# EAGLE design mainTest (EAGLE 7.6.0)
Components for pcb
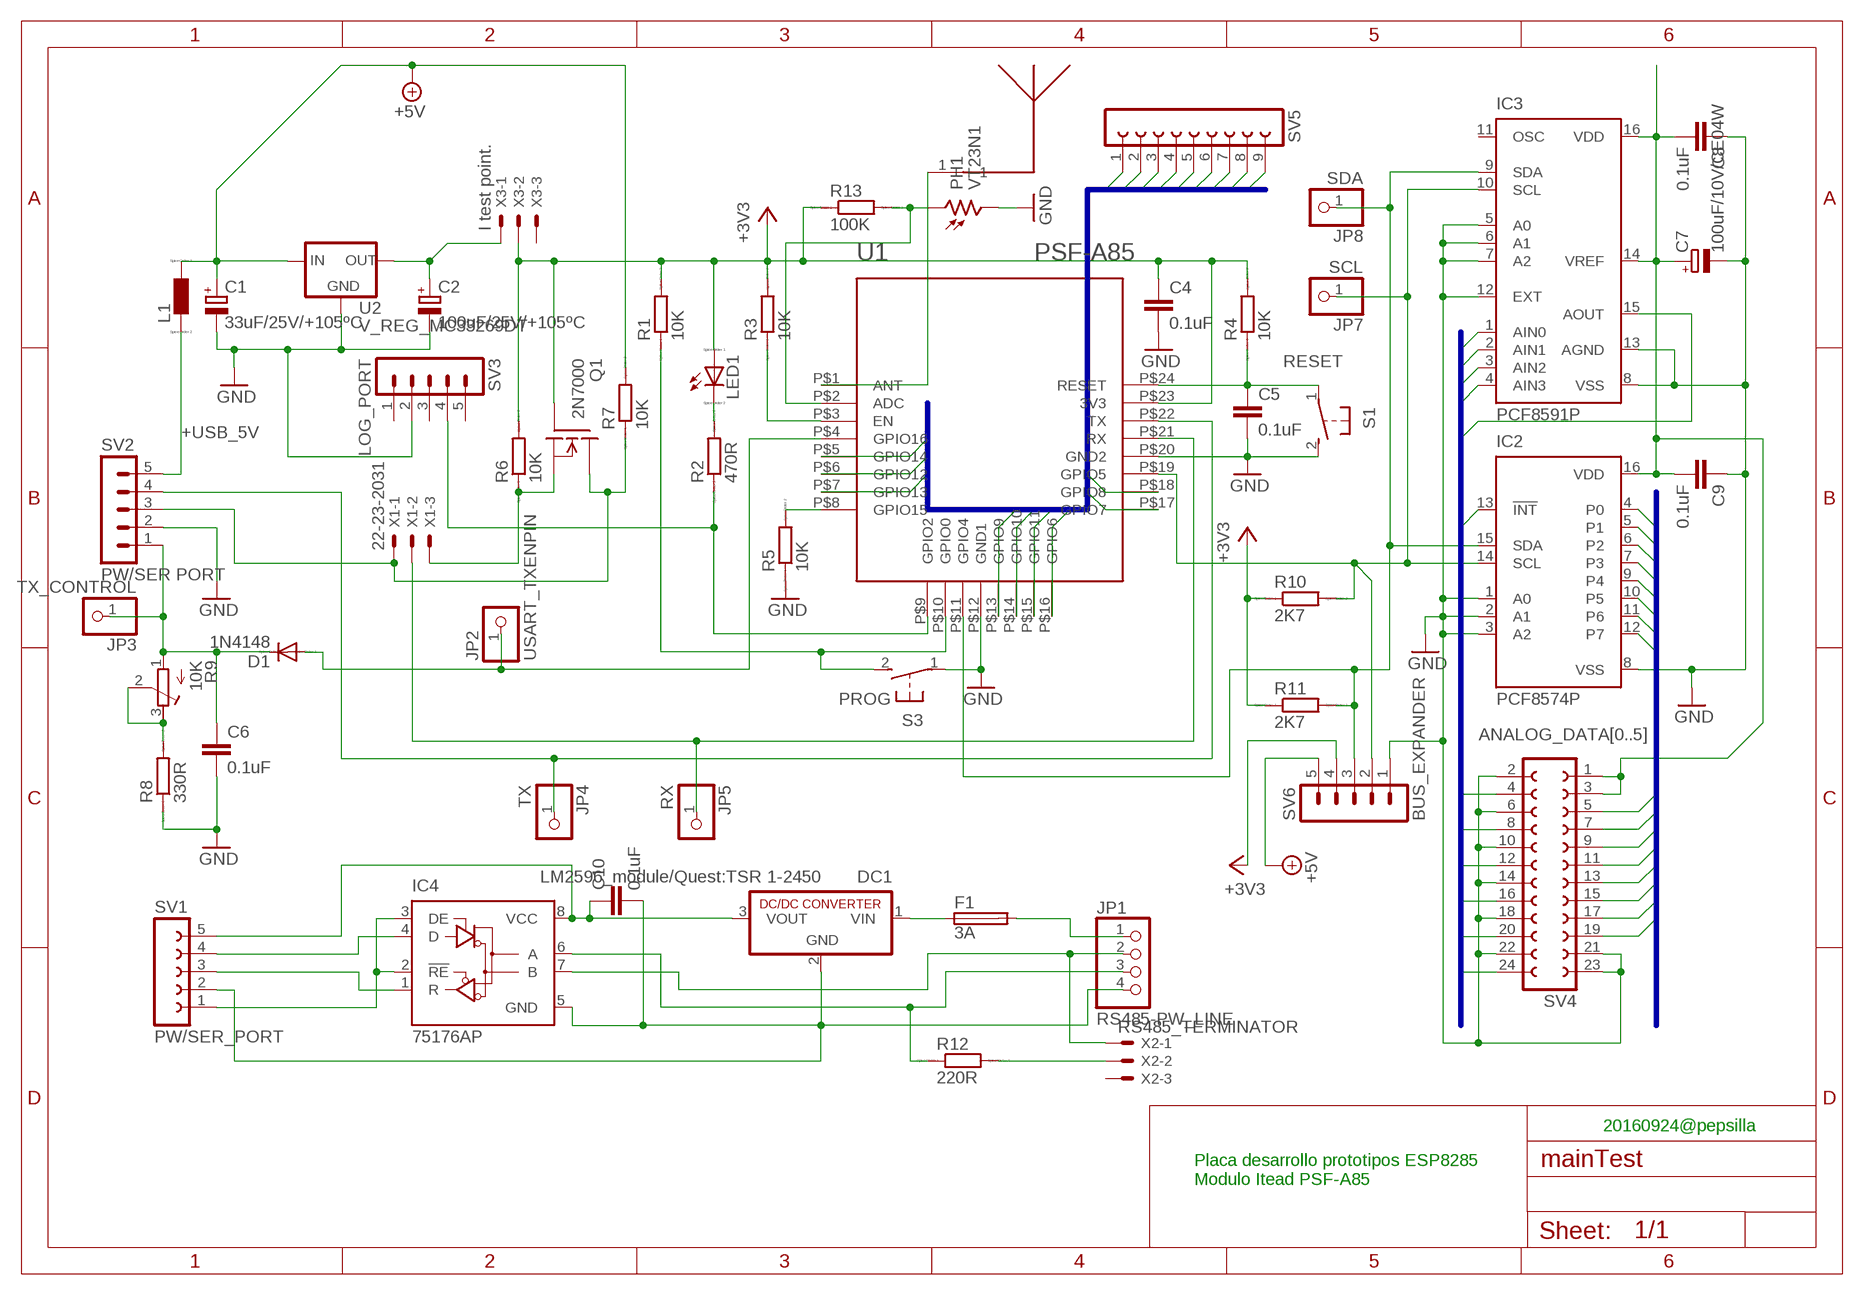
[diagram p0: schematic, sheet 1]

## Parts
C1  33uF/25V/+105ºC  CPOL-EUE3.5-10  [E3,5-10]
C2  100uF/25V/+105ºC  CPOL-EUE3.5-10  [E3,5-10]
C4  0.1uF  C-EU025-030X050  [C025-030X050]
C5  0.1uF  C-EU025-030X050  [C025-030X050]
C6  0.1uF  C-EU025-030X050  [C025-030X050]
C7  100uF/10V/CE04W  CPOL-EUE3.5-10  [E3,5-10]
C8  0.1uF  C-EU025-030X050  [C025-030X050]
C9  0.1uF  C-EU025-030X050  [C025-030X050]
C10  0.1uF  C-EU025-030X050  [C025-030X050]
D1  1N4148  MBR0520LT  [SOD123]
DC1  LM2596_module/Quest:TSR 1-2450  R-78C9.0-1.0  [SIP3]
F1  3A  TR5  [TR5]
IC2  PCF8574P  [DIL16]
IC3  PCF8591P  [DIL16]
IC4  75176AP  [DIL08]
JP1  RS485-PW_LINE  PINHD-1X4  [1X04]
JP2  USART_TXENPIN  PINHD-1X1  [1X01]
JP3  TX_CONTROL  PINHD-1X1  [1X01]
JP4  TX  PINHD-1X1  [1X01]
JP5  RX  PINHD-1X1  [1X01]
JP7  SCL  PINHD-1X1  [1X01]
JP8  SDA  PINHD-1X1  [1X01]
L1  L0207/10  [0207/10]
LED1  LED_E  [LED_1206]
PH1  VT23N1  [TO46-VT200]
Q1  2N7000  BSS295  [TO92]
R1  10K  R  [R0805]
R2  470R  R  [R0805]
R3  10K  R  [R0805]
R4  10K  R  [R0805]
R5  10K  R  [R0805]
R6  10K  R  [R0805]
R7  10K  R  [R0805]
R8  330R  R  [R0805]
R9  10K  R-TRIMM3296X  [RTRIM3296X]
R10  2K7  R  [R0805]
R11  2K7  R  [R0805]
R12  220R  R  [R0805]
R13  100K  R  [R0805]
S1  31-XX  [B3F-31XX]
S3  31-XX  [B3F-31XX]
SV1  PW/SER_PORT  FE05-1  [FE05-1]
SV2  PW/SER PORT  MA05-1  [MA05-1]
SV3  LOG_PORT  MA05-1  [MA05-1]
SV4  FE12-2  [FE12-2]
SV5  FE09-1  [FE09]
SV6  BUS_EXPANDER  MA05-1  [MA05-1]
U1  PSF-A85  [PSF-A85]
U2  V_REG_MC33269DT  [DPAK]
U$1  PCB-2G4-ANTENNA  [PCB-2G4-ANTENNA]
X1  22-23-2031  [22-23-2031]
X2  RS485_TERMINATOR  22-23-2031  [22-23-2031]
X3  I test point.  22-23-2031  [22-23-2031]

## Nets
+3V3: C4.1 LED1.A Q1.1(G) R1.2 R3.2 R4.2 R6.2 R10.1 R11.1 R13.1 SV6.4 U1.P$23(3V3) X3.2
+5V: C1.+ L1.1 R7.2 SV6.5 U2.3(IN)
+USB_5V: L1.2 SV2.5
ANALOG_DATA0: IC3.4(AIN3) SV4.4
ANALOG_DATA1: IC3.3(AIN2) SV4.8
ANALOG_DATA2: IC3.2(AIN1) SV4.12
ANALOG_DATA3: IC3.1(AIN0) SV4.16
ANALOG_DATA4: IC3.15(AOUT) SV4.20
ANALOG_DATA5: IC2.13(!INT) SV4.24
DIGITAL_DATA0: IC2.4(P0) SV4.5
DIGITAL_DATA1: IC2.5(P1) SV4.7
DIGITAL_DATA2: IC2.6(P2) SV4.9
DIGITAL_DATA3: IC2.7(P3) SV4.11
DIGITAL_DATA4: IC2.9(P4) SV4.13
DIGITAL_DATA5: IC2.10(P5) SV4.15
DIGITAL_DATA6: IC2.11(P6) SV4.17
DIGITAL_DATA7: IC2.12(P7) SV4.19
GND: C1.- C2.- C4.2 C5.2 C6.2 C7.- C8.1 C9.1 IC2.1(A0) IC2.2(A1) IC2.3(A2) IC2.8(VSS) IC3.5(A0) IC3.6(A1) IC3.7(A2) IC3.8(VSS) IC3.12(EXT) IC3.13(AGND) PH1.2 R5.1 R8.1 S1.2(S) S3.1(P) SV2.2 SV3.2 SV4.2 SV4.6 SV4.10 SV4.14 SV4.18 SV4.21 SV4.22 SV4.23 SV6.1 U1.P$12(GND1) U1.P$20(GND2) U2.1(GND)
N$1: PH1.1 R13.2 U1.P$2(ADC)
N$2: R3.1 U1.P$3(EN)
N$3: R2.1 SV3.4 U1.P$9(GPIO2)
N$4: R1.1 S3.2(S) U1.P$10(GPIO0)
N$5: R5.2 U1.P$8(GPIO15)
N$6: DC1.1(VIN) F1.1
N$7: IC2.15(SDA) IC3.9(SDA) JP8.1 R11.2 SV6.3 U1.P$11(GPIO4)
N$8: C10.1 DC1.3(VOUT) IC4.8(VCC) SV1.5
N$9: C10.2 DC1.2(GND) IC4.5(GND) JP1.4 SV1.2
N$10: IC2.14(SCL) IC3.10(SCL) JP7.1 R10.2 SV6.2 U1.P$19(GPIO5)
N$11: F1.2 JP1.1
N$12: R8.2 R9.2(S) R9.3(E)
N$13: Q1.3(S) R6.1 X1.3
N$14: LED1.C R2.2
N$15: D1.A JP2.1 U1.P$4(GPIO16)
N$16: IC4.7(B) JP1.2 X2.1
N$17: IC4.6(A) JP1.3 R12.1
N$18: IC4.2(!RE) IC4.3(DE) SV1.1
N$19: IC4.1(R) SV1.3
N$20: IC4.4(D) SV1.4
N$21: R12.2 X2.2
N$22: C2.+ U2.4(OUT) X3.1
N$24: C6.1 D1.C JP3.1 R9.1(A) SV2.1
N$32: C7.+ C8.2 C9.2 IC2.16(VDD) IC3.14(VREF) IC3.16(VDD) SV4.1 SV4.3
N$33: U1.P$1(ANT) U$1.1
PIN_HEADER0: SV5.1 U1.P$5(GPIO14)
PIN_HEADER1: SV5.2 U1.P$6(GPIO12)
PIN_HEADER2: SV5.3 U1.P$7(GPIO13)
PIN_HEADER3: SV5.4 U1.P$13(GPIO9)
PIN_HEADER4: SV5.5 U1.P$14(GPIO10)
PIN_HEADER5: SV5.6 U1.P$15(GPIO11)
PIN_HEADER6: SV5.7 U1.P$16(GPIO6)
PIN_HEADER7: SV5.8 U1.P$17(GPIO7)
PIN_HEADER8: SV5.9 U1.P$18(GPIO8)
PROG: JP5.1 U1.P$21(RX) X1.2
RESET: C5.1 R4.1 S1.1(P) U1.P$24(RESET)
RX: JP4.1 SV2.4 U1.P$22(TX)
TX: Q1.2(D) R7.1 SV2.3 X1.1
Unconnected: IC3.11(OSC) SV3.1 SV3.3 SV3.5 X2.3 X3.3

## Buses
DIGITAL_DATA[0..7]
ANALOG_DATA[0..5]
PIN_HEADER[0..8]

## Notes on the sheet
- 20160924@pepsilla
- Placa desarrollo prototipos ESP8285
  Modulo Itead PSF-A85

## Library data of the parts
C1 C2 C7 = rcl:CPOL-EU: POLARIZED CAPACITOR, European symbol
C4-C6 C8-C10 = rcl:C-EU: CAPACITOR, European symbol
D1 = diode:MBR0520LT: SCHOTTKY BARRIER RECTIFIER Source: http://onsemi.com .. MBR0520LT1-D.pdf
DC1 = dc-dc-converter:R-78C*-1.0: INNOLINE DC/DC-Converter 1.0 AMP SIP3 Single Output Source: Data sheet <http://www.mikrocontroller.net/attachment/150645/157764-da-01-en-DC_DC_WANDLER_R_78C5_0_1_0.pdf>
F1 = fuse:TR5: FUSE Wickmann; OC_FARNELL: unknown; OC_NEWARK: unknown
IC2 = micro-philips:PCF8574: I2C-Bus Remote 8-bit I/O expander http://www.semiconductors.philips.com/acrobat_download/datasheets/PCF8574_4.pdf; MPN: PCF8574PN; OC_FARNELL: 204020; OC_NEWARK: 11N8515
IC3 = micro-philips:PCF8591: I2C-Bus D/A CONVERTER; MF: FARNELL; MPN: PCF8591P; OC_FARNELL: 396412; OC_NEWARK: 07WX3385
IC4 = 751xx:75176A: DIFFERENTIAL BUS TRANSCEIVER Source: http://focus.ti.com/lit/ds/symlink/sn75176a.pdf
JP1 = pinhead:PINHD-1X4: PIN HEADER
JP2-JP5 JP7 JP8 = pinhead:PINHD-1X1: PIN HEADER
L1 = eagle-ltspice:L: INDUCTOR, European symbol; SPICEMODEL: NONE; SPICEPREFIX: L
LED1 = eagle-ltspice:LED_E: LED Source: http://www.osram.convergy.de Source: www.luxeon.com Source: www.kingbright.com; SPICEMODEL: NONE; SPICEPREFIX: D; SPICETYPE: diode
PH1 = photo-elements:VT2*: Photoconductive Cell VT200 Series Source: http://optoelectronics.perkinelmer.com/content/Datasheets/DTS_vt200seriesdatasheet.pdf
Q1 = transistor-fet:BSS295: N-Channel Enhancement MOSFET not checked
R1-R8 R10-R13 = eagle-ltspice:R: RESISTOR, European symbol; SPICEMODEL: NONE; SPICEPREFIX: R
R9 = resistor:R-TRIMM: Trimm resistor
S1 S3 = switch-omron:31-XX: OMRON SWITCH; MPN: B3F-3100; OC_FARNELL: 959704; OC_NEWARK: 36M3582
SV1 = con-lsta:FE05-1: FEMALE HEADER; OC_FARNELL: unknown; OC_NEWARK: unknown
SV2 SV3 SV6 = con-lstb:MA05-1: PIN HEADER; OC_FARNELL: unknown; OC_NEWARK: unknown
SV4 = con-lsta:FE12-2: FEMALE HEADER; OC_FARNELL: unknown; OC_NEWARK: unknown
SV5 = con-lsta:FE09-1: FEMALE HEADER; OC_FARNELL: unknown; OC_NEWARK: unknown
U1 = ITEAD:PSF-A85
U2 = SparkFun-PowerIC:V_REG_MC33269
U$1 = ITEAD:PCB-2G4-ANTENNA
X1-X3 = con-molex:22-23-2031: .100" (2.54mm) Center Header - 3 Pin; MF: MOLEX; MPN: 22-23-2031; OC_FARNELL: 1462950; OC_NEWARK: 30C0862

## Board
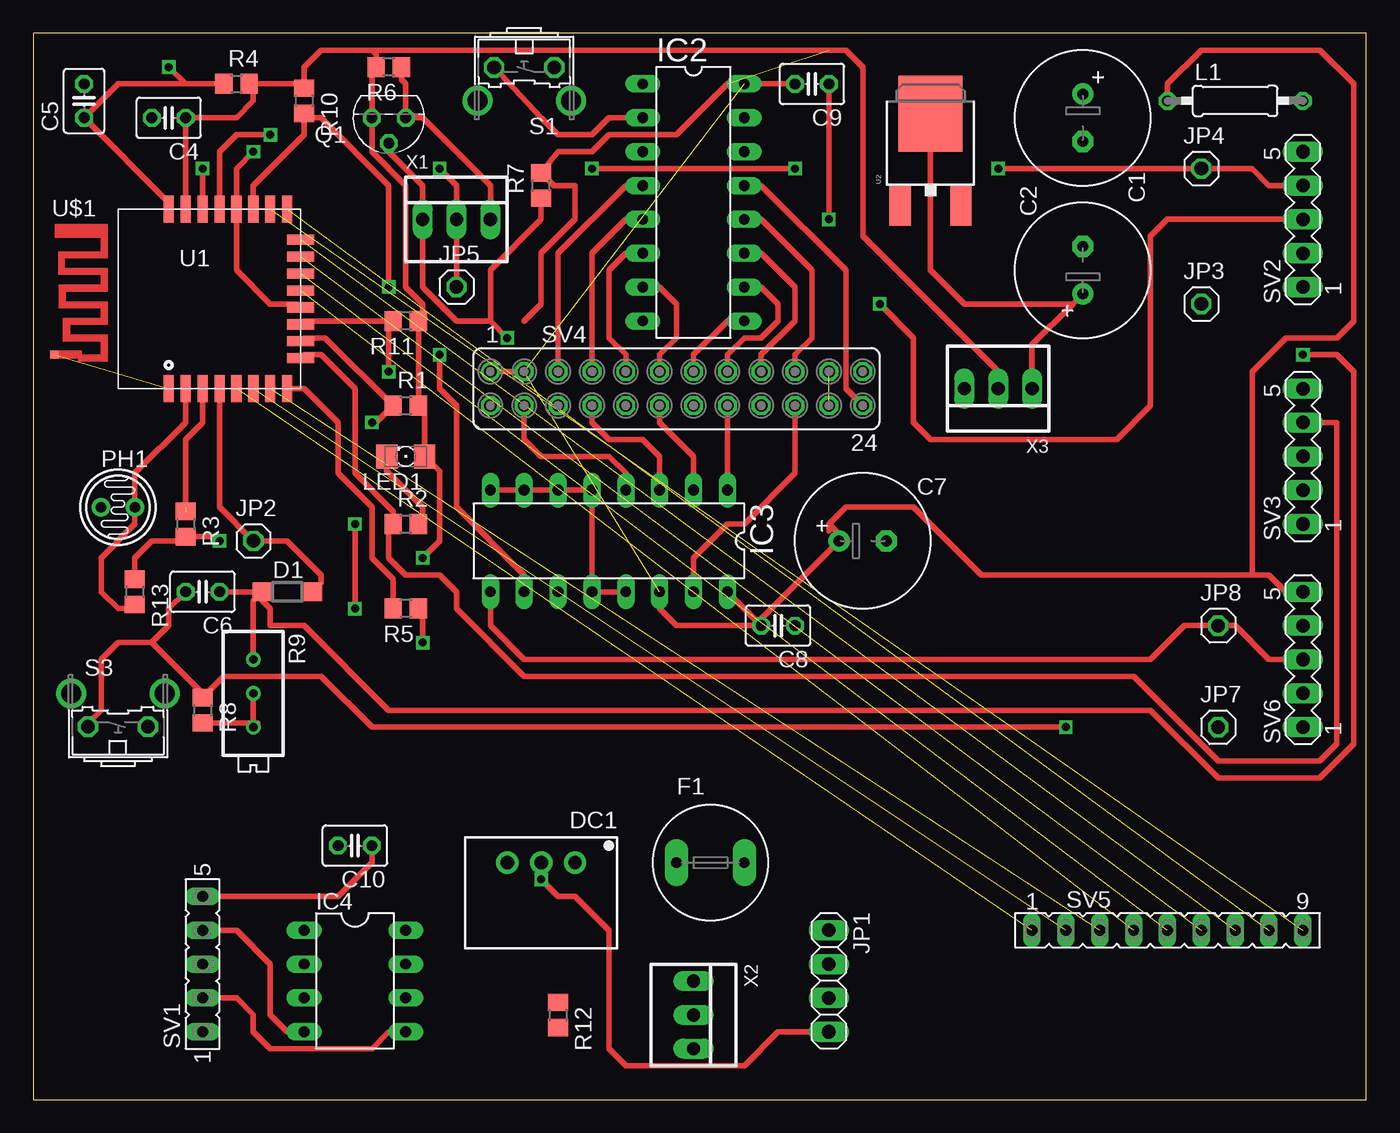
[diagram p1: board, top side]
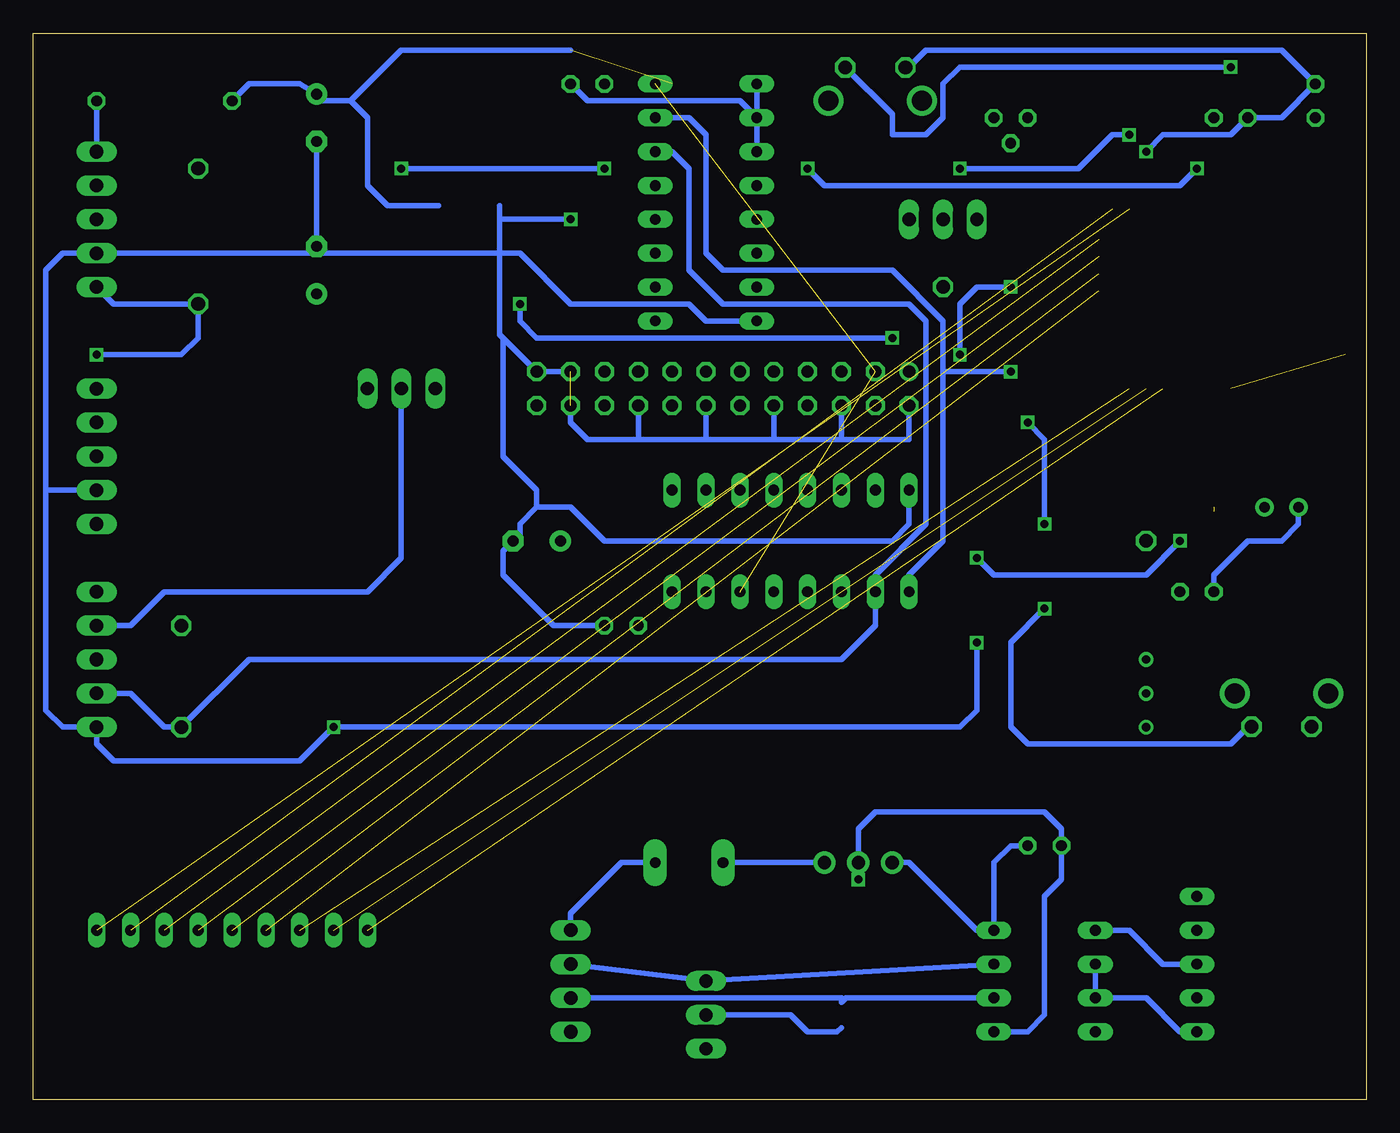
[diagram p2: board, bottom side, seen from below]

Size 100 x 80 mm. Coordinates in mm from the lower left corner, seen from the top.
Outline: 0,0 100,0 100,80 0,80 0,0
Copper layers (1*16): Top 0.035mm / dielectric 1.5mm / Bottom 0.035mm
Design rules "default": minimum track width 10mil, minimum drill 24mil, track to track 8mil, track to pad 8mil, pad to pad 8mil, via to via 8mil, smd to smd 8mil, copper to edge 40mil, drill to drill 8mil, minimum pad ring 10mil, minimum via ring 8mil, stop-mask expansion 4mil, vias tented up to drill 0mil, thermal gap 10mil

### Footprints (pad centres in the part's own frame; a part is rotated, then mirrored left to right if it is on the bottom)
E3,5-10 = drill 0.813 pad 1.6: + -1.778,0 | drill 0.813 pad 1.6 octagon: - 1.778,0
C025-030X050 = drill 0.813 octagon: 1 -1.27,0; 2 1.27,0
SOD123 = smd 1.4 x 1.4: A 1.9,0; C -1.9,0
SIP3 = drill 1 pad 1.676: 1 -2.54,0; 2 0,0; 3 2.54,0
TR5 = drill 0.813 pad 1.778 long: 1 -2.54,0; 2 2.54,0
DIL16 = drill 0.813 long: 1 -8.89,-3.81; 2 -6.35,-3.81; 3 -3.81,-3.81; 4 -1.27,-3.81; 5 1.27,-3.81; 6 3.81,-3.81; 7 6.35,-3.81; 8 8.89,-3.81; 9 8.89,3.81; 10 6.35,3.81; 11 3.81,3.81; 12 1.27,3.81; 13 -1.27,3.81; 14 -3.81,3.81; 15 -6.35,3.81; 16 -8.89,3.81
DIL08 = drill 0.813 long: 1 -3.81,-3.81; 2 -1.27,-3.81; 3 1.27,-3.81; 4 3.81,-3.81; 5 3.81,3.81; 6 1.27,3.81; 7 -1.27,3.81; 8 -3.81,3.81
1X04 = drill 1.016 long: 1 -3.81,0; 2 -1.27,0; 3 1.27,0; 4 3.81,0
1X01 = drill 1.016 octagon: 1 0,0
0207/10 = drill 0.813 octagon: 1 -5.08,0; 2 5.08,0
LED_1206 = smd 1.6 x 1.803: A -1.422,0; C 1.422,0
TO46-VT200 = drill 0.8 pad 1.4: 1 -1.27,0; 2 1.27,0
TO92 = drill 0.813 octagon: 1 1.27,0; 2 0,1.905; 3 -1.27,0
R0805 = smd 1.3 x 1.5: 1 -0.95,0; 2 0.95,0
RTRIM3296X = drill 0.61: 1 0,-2.54; 2 0,0; 3 0,2.54
B3F-31XX = drill 1.016 octagon: 1 -2.261,-1.245; 2 2.261,-1.245 | drill 1.499 pad 2.159: 3 -3.505,1.245; 4 3.505,1.245
FE05-1 = drill 0.813 long: 1 -5.08,0; 2 -2.54,0; 3 0,0; 4 2.54,0; 5 5.08,0
MA05-1 = drill 1.016 long: 1 -5.08,0; 2 -2.54,0; 3 0,0; 4 2.54,0; 5 5.08,0
FE12-2 = drill 0.914: 1 -13.97,1.27 | drill 0.914 octagon: 2 -13.97,-1.27; 3 -11.43,1.27; 4 -11.43,-1.27; 5 -8.89,1.27; 6 -8.89,-1.27; 7 -6.35,1.27; 8 -6.35,-1.27; 9 -3.81,1.27; 10 -3.81,-1.27; 11 -1.27,1.27; 12 -1.27,-1.27; 13 1.27,1.27; 14 1.27,-1.27; 15 3.81,1.27; 16 3.81,-1.27; 17 6.35,1.27; 18 6.35,-1.27; 19 8.89,1.27; 20 8.89,-1.27; 21 11.43,1.27; 22 11.43,-1.27; 23 13.97,1.27; 24 13.97,-1.27
FE09 = drill 0.813 long: 1 -10.16,0; 2 -7.62,0; 3 -5.08,0; 4 -2.54,0; 5 0,0; 6 2.54,0; 7 5.08,0; 8 7.62,0; 9 10.16,0
PSF-A85 = smd 0.762 x 2.032: P$1 3.81,0; P$2 5.08,0; P$3 6.35,0; P$4 7.62,0; P$5 8.89,0; P$6 10.16,0; P$7 11.43,0; P$8 12.7,0; P$17 12.7,13.462; P$18 11.43,13.462; P$19 10.16,13.462; P$20 8.89,13.462; P$21 7.62,13.462; P$22 6.35,13.462; P$23 5.08,13.462; P$24 3.81,13.462 | smd 2.032 x 0.762: P$9 13.716,2.286; P$10 13.716,3.556; P$11 13.716,4.826; P$12 13.716,6.096; P$13 13.716,7.366; P$14 13.716,8.636; P$15 13.716,9.906; P$16 13.716,11.176
DPAK = smd 1.6 x 3: 1 -2.28,-5.31; 3 2.28,-5.31 | smd 4.826 x 5.715: 4 0,1.588
PCB-2G4-ANTENNA = smd 0.6 x 0.6: 1 0.3,0
22-23-2031 = drill 1 long: 1 -2.54,0; 2 0,0; 3 2.54,0

### Placement (x,y rotation side)
C1  78.74,73.66 270 top
C2  78.74,62.23 90 top
C4  10.16,73.66 180 top
C5  3.81,74.93 90 top
C6  12.7,38.1 180 top
C7  62.23,41.91 0 top
C8  55.88,35.56 180 top
C9  58.42,76.2 180 top
C10  24.13,19.05 180 top
D1  19.05,38.1 0 top
DC1  38.1,17.78 180 top
F1  50.8,17.78 0 top
IC2  49.53,67.31 270 top
IC3  43.18,41.91 180 top
IC4  24.13,8.89 270 top
JP1  59.69,8.89 270 top
JP2  16.51,41.91 0 top
JP3  87.63,59.69 0 top
JP4  87.63,69.85 0 top
JP5  31.75,60.96 0 top
JP7  88.9,27.94 0 top
JP8  88.9,35.56 0 top
L1  90.17,74.93 0 top
LED1  27.94,48.26 180 top
PH1  6.35,44.45 180 top
Q1  26.67,73.66 180 top
R1  27.94,52.07 0 top
R2  27.94,43.18 0 top
R3  11.43,43.18 270 top
R4  15.24,76.2 0 top
R5  27.94,36.83 180 top
R6  26.67,77.47 180 top
R7  38.1,68.58 90 top
R8  12.7,29.21 270 top
R9  16.51,30.48 180 top
R10  20.32,74.93 270 top
R11  27.94,58.42 180 top
R12  39.37,6.35 270 top
R13  7.62,38.1 270 top
S1  36.83,76.2 180 top
S3  6.35,29.21 0 top
SV1  12.7,10.16 90 top
SV2  95.25,66.04 90 top
SV3  95.25,48.26 90 top
SV4  48.26,53.34 0 top
SV5  85.09,12.7 0 top
SV6  95.25,33.02 90 top
U1  6.35,53.34 0 top
U2  67.31,72.39 0 top
U$1  1.27,55.88 0 top
X1  31.75,66.04 0 top
X2  49.53,6.35 270 top
X3  72.39,53.34 180 top

### Tracks (layer width: path | path; a pad name or v marks a point on that pad's centre or on a via)
+3V3  (via drill 0.6)
  Top 0.406: U1.P$23 C4.1 15.24,73.66 16.51,74.93 16.51,75.88 R4.2 20,76.2 R10.1 20.32,77.47 21.59,78.74 25.4,78.74 | X3.2 72.39,54.61 62.23,64.77 62.23,77.47 60.96,78.74 25.4,78.74 | 25.4,78.74 25.72,78.42 R6.2 25.4,77.15 Q1.1 25.4,71.12 27.94,68.58 27.94,60.96 29.21,59.69 29.21,58.74 R11.1 R1.2 29.36,51.6 LED1.A 30.48,47.14 30.48,41.91 v29.21,40.64 | R13.1 7.62,40.64 8.89,41.91 11.11,41.91 R3.2 13.65,42.23 v13.97,41.91
  Bottom 0.406: v13.97,41.91 16.51,39.37 27.94,39.37 v29.21,40.64 | X3.2 72.39,40.64 74.93,38.1 90.17,38.1 92.71,35.56 SV6.4
+5V  (2 unrouted)
  Top 0.406: 52.07,76.2 48.26,72.39 43.18,72.39 41.91,71.12 39.37,71.12 R7.2 39.05,68.58 40.64,68.58 40.64,66.04 38.1,63.5 38.1,59.69 36.83,58.42 | SV6.5 93.98,38.1 92.71,39.37 91.44,39.37 | 59.69,43.18 59.69,42.67 | 60.96,41.91 59.69,43.18 | 59.69,43.18 60.96,44.45 66.04,44.45 71.12,39.37 91.44,39.37 | 91.44,39.37 91.44,54.61 93.98,57.15 97.79,57.15 99.06,58.42 99.06,76.2 96.52,78.74 87.63,78.74 85.09,76.2 L1.1
  Bottom 0.406: 76.2,74.93 78.74,74.93 C1.+ 80.01,76.2 83.82,76.2 L1.1 | 76.2,74.93 74.93,73.66 74.93,68.58 73.43,67.08 U2.3 | 59.69,78.74 72.39,78.74 76.2,74.93
+USB_5V
  Bottom 0.406: SV2.5 L1.2
ANALOG_DATA0
  Top 0.406: IC3.4 44.45,46.99 43.18,48.26 38.1,48.26 36.83,49.53 SV4.4
ANALOG_DATA1
  Top 0.406: IC3.3 46.99,48.26 45.72,49.53 43.18,49.53 41.91,50.8 SV4.8
ANALOG_DATA2
  Top 0.406: IC3.2 49.53,48.26 46.99,50.8 SV4.12
ANALOG_DATA3
  Top 0.406: IC3.1 SV4.16
ANALOG_DATA4
  Top 0.406: IC3.15 49.53,40.64 52.07,43.18 53.34,43.18 57.15,46.99 SV4.20
ANALOG_DATA5
  Top 0.406: SV4.24 60.96,53.34 60.96,62.23 54.61,68.58 IC2.13
DIGITAL_DATA0
  Top 0.406: IC2.4 44.45,68.58 39.37,63.5 SV4.5
DIGITAL_DATA1
  Top 0.406: IC2.5 44.45,66.04 41.91,63.5 SV4.7
DIGITAL_DATA2
  Top 0.406: IC2.6 44.45,63.5 43.18,62.23 43.18,57.15 44.45,55.88 SV4.9
DIGITAL_DATA3
  Top 0.406: IC2.7 46.99,60.96 48.26,59.69 48.26,57.15 46.99,55.88 SV4.11
DIGITAL_DATA4
  Top 0.406: IC2.9 52.07,58.42 49.53,55.88 SV4.13
DIGITAL_DATA5
  Top 0.406: IC2.10 54.61,60.96 55.88,59.69 55.88,58.42 54.61,57.15 53.34,57.15 52.07,55.88 SV4.15
DIGITAL_DATA6
  Top 0.406: IC2.11 54.61,63.5 57.15,60.96 57.15,58.42 54.61,55.88 SV4.17
DIGITAL_DATA7
  Top 0.406: IC2.12 54.61,66.04 58.42,62.23 58.42,57.15 57.15,55.88 SV4.19
GND  (via drill 0.6)  (2 unrouted)
  Top 0.406: IC3.8 IC3.7 IC3.6 IC3.5 IC3.12 IC3.13 | U1.P$12 19.81,59.69 17.78,59.69 15.24,62.23 U1.P$20 15.24,69.85 v16.51,71.12 | C9.1 v59.69,66.04 | S1.2 38.1,73.66 39.37,72.39 41.91,72.39 43.18,73.66 IC2.2 | S3.1 4.09,28.22 5.08,29.21 5.08,33.02 6.35,34.29 8.89,34.29 | 8.89,34.29 10.16,35.56 10.16,36.83 C6.2 | 8.89,34.29 12.7,30.48 R8.1 14.29,31.75 21.59,31.75 25.4,27.94 v77.47,27.94 | R5.1 29.21,36.51 v29.21,34.29
  Bottom 0.406: SV4.21 SV4.23 64.77,57.15 | 65.03,63.5 65.03,57.41 64.77,57.15 | 65.03,63.5 65.03,66.04 | 65.03,66.04 U2.1 | 78.74,72.39 C1.- C2.- | C2.- 78.23,63.5 65.03,63.5 | v16.51,71.12 15.24,72.39 10.16,72.39 C4.2 6.35,73.66 C5.2 6.35,78.74 33.02,78.74 34.31,77.44 S1.2 | IC2.1 IC2.2 | SV4.2 34.29,49.53 39.37,49.53 | 39.37,49.53 44.45,49.53 | 44.45,49.53 49.53,49.53 | 49.53,49.53 54.61,49.53 | 54.61,49.53 58.42,49.53 59.69,50.8 SV4.22 | SV4.6 39.37,49.53 | SV4.10 44.45,49.53 | SV4.14 49.53,49.53 | SV4.18 54.61,49.53 | v59.69,66.04 65.03,66.04 | IC2.8 49.53,58.42 50.8,59.69 59.69,59.69 63.5,63.5 65.03,63.5 | IC3.8 34.29,43.18 35.56,41.91 57.15,41.91 59.69,44.45 62.23,44.45 | 62.23,44.45 63.5,43.18 63.5,42.42 C7.- 64.77,41.15 64.77,39.37 60.96,35.56 C8.1 | 62.23,44.45 62.23,45.72 64.77,48.26 64.77,57.15 | C6.2 11.43,39.37 8.89,41.91 6.35,41.91 5.08,43.18 PH1.2 | 99.06,45.72 99.06,29.21 97.79,27.94 SV6.1 95.25,26.67 93.98,25.4 80.01,25.4 v77.47,27.94 30.48,27.94 29.21,29.21 v29.21,34.29 | SV3.2 99.06,45.72 | 99.06,45.72 99.06,62.23 97.79,63.5 SV2.2 79.25,63.5 C2.- | IC2.3 IC2.2 | IC2.2 46.99,74.93 58.42,74.93 C9.1
N$1
  Top 0.406: U1.P$2 11.43,50.8 7.62,46.99 PH1.1 7.62,43.18 5.08,40.64 5.08,38.1 6.35,36.83 7.3,36.83 R13.2
N$2  (1 unrouted)
  Top 0.406: U1.P$3 12.7,50.8 11.43,49.53 11.43,44.45
N$3
  Top 0.406: U1.P$9 20.32,55.88 21.59,55.88 24.13,53.34 24.13,46.99 26.99,44.13 R2.1 26.67,42.86 26.67,40.64 27.94,39.37 30.48,39.37 31.75,38.1 31.75,36.83 36.83,31.75 82.55,31.75 88.9,25.4 96.52,25.4 97.79,26.67 97.79,50.8 SV3.4
N$4  (via drill 0.6)
  Top 0.406: U1.P$10 20.32,57.15 21.91,57.15 R1.1 25.72,50.8 v25.4,50.8 | v24.13,36.83 v24.13,43.18
  Bottom 0.406: S3.2 8.87,27.96 10.16,26.67 25.4,26.67 26.67,27.94 26.67,34.29 v24.13,36.83 | v24.13,43.18 24.13,49.53 v25.4,50.8
N$5
  Top 0.406: R5.2 26.99,39.05 25.4,40.64 25.4,44.45 22.86,46.99 22.86,50.8 20.32,53.34 U1.P$8
N$6
  Bottom 0.406: F1.1 DC1.1
N$7  (via drill 0.6)
  Top 0.406: 26.67,58.42 R11.2 | U1.P$11 20.32,58.42 26.67,58.42 | 26.67,58.42 v26.67,54.61 | IC3.9 34.29,35.56 36.83,33.02 83.82,33.02 86.36,35.56 JP8.1 90.17,35.56 92.71,33.02 SV6.3
  Bottom 0.406: IC3.9 34.29,39.37 31.75,41.91 31.75,54.61 | 31.75,54.61 31.75,58.42 35.56,62.23 48.26,62.23 49.53,63.5 49.53,72.39 50.8,73.66 IC2.15 | v26.67,54.61 31.75,54.61
N$8
  Top 0.406: C10.1 25.4,17.78 22.86,15.24 SV1.5
  Bottom 0.406: DC1.3 34.29,17.78 29.21,12.7 IC4.8 27.94,17.78 26.67,19.05 C10.1
N$9  (via drill 0.6)
  Top 0.406: JP1.4 55.88,5.08 53.34,2.54 44.45,2.54 43.18,3.81 43.18,12.7 40.64,15.24 39.37,15.24 v38.1,16.51 DC1.2 | SV1.2 15.24,7.62 16.51,6.35 16.51,5.08 17.78,3.81 25.4,3.81 26.67,5.08 IC4.5
  Bottom 0.406: IC4.5 25.4,5.08 24.13,6.35 24.13,15.24 22.86,16.51 C10.2 22.86,20.32 24.13,21.59 36.83,21.59 38.1,20.32 v38.1,16.51
N$10  (via drill 0.6)
  Top 0.406: R10.2 20.32,73.66 | U1.P$19 16.51,68.58 20.32,72.39 20.32,73.66 | 20.32,73.66 21.59,73.66 26.67,68.58 v26.67,60.96 | v30.48,55.88 30.48,53.34 31.75,52.07 31.75,44.45 36.83,39.37 IC3.10
  Bottom 0.406: IC2.14 52.07,71.12 50.8,69.85 50.8,62.23 48.26,59.69 34.29,59.69 33.02,58.42 33.02,43.18 36.83,39.37 IC3.10 36.83,35.56 39.37,33.02 83.82,33.02 JP7.1 90.17,27.94 92.71,30.48 SV6.2 | v26.67,60.96 29.21,60.96 30.48,59.69 v30.48,55.88
N$11
  Bottom 0.406: JP1.1 59.69,13.97 55.88,17.78 F1.2
N$12
  Top 0.406: R8.2 16.83,28.26 R9.3 R9.2
N$13
  Top 0.406: R6.1 27.62,76.52 27.94,76.2 Q1.3 29.21,73.66 34.29,68.58 X1.3
N$14
  Top 0.406: LED1.C 26.52,47.14 29.21,44.45 29.21,43.5 R2.2
N$15
  Top 0.406: U1.P$4 13.97,44.45 JP2.1 19.05,41.91 21.59,39.37 21.59,38.74 D1.A
N$16
  Bottom 0.406: JP1.2 X2.1 IC4.7
N$17  (1 unrouted)
  Bottom 0.406: IC4.6 39.05,7.62 R12.1 39.37,7.62 JP1.3
N$18
  Bottom 0.406: SV1.1 13.97,5.08 16.51,7.62 IC4.3 IC4.2
N$19
  Bottom 0.406: IC4.1 17.78,12.7 15.24,10.16 SV1.3
N$20
  Top 0.406: IC4.4 19.05,5.08 17.78,6.35 17.78,10.16 15.24,12.7 SV1.4
N$21  (1 unrouted)
  Bottom 0.406: X2.2 43.18,6.35 41.91,5.08 39.69,5.08 R12.2
N$22
  Top 0.406: C2.+ 77.98,59.69 | 77.98,59.69 69.85,59.69 67.31,62.23 U2.4 | 77.98,59.69 74.93,56.64 X3.1
N$23  (via drill 0.6)
  other vias: 12.7,69.85
N$24  (via drill 0.6)
  Top 0.406: R9.1 16.51,37.46 D1.C | D1.C C6.1 | D1.C 17.15,37.46 17.78,36.83 17.78,35.56 20.32,35.56 26.67,29.21 83.82,29.21 88.9,24.13 96.52,24.13 99.06,26.67 99.06,54.61 97.79,55.88 v95.25,55.88
  Bottom 0.406: SV2.1 93.98,59.69 JP3.1 87.63,57.15 88.9,55.88 v95.25,55.88
N$25  (via drill 0.6)
  other vias: 17.78,72.39
N$26  (via drill 0.6)
  other vias: 16.51,71.12
N$27  (via drill 0.6)
  other vias: 10.16,77.47
N$28  (via drill 0.6)
  other vias: 41.91,69.85
N$29  (via drill 0.6)
  other vias: 57.15,69.85
N$30  (via drill 0.6)
  other vias: 72.39,69.85
N$31  (via drill 0.6)
  other vias: 30.48,69.85
N$32  (2 unrouted)
  Top 0.406: IC3.16 C8.2 | C7.+ 54.61,36.07 C8.2 | IC2.16 C9.2 | SV4.1 SV4.3 | IC3.14 46.99,36.83 48.26,35.56 C8.2
N$33  (1 unrouted)
PIN_HEADER0  (1 unrouted)
PIN_HEADER1  (1 unrouted)
PIN_HEADER2  (1 unrouted)
PIN_HEADER3  (1 unrouted)
PIN_HEADER4  (1 unrouted)
PIN_HEADER5  (1 unrouted)
PIN_HEADER6  (1 unrouted)
PIN_HEADER7  (1 unrouted)
PIN_HEADER8  (1 unrouted)
PROG  (via drill 0.6)
  Top 0.406: U1.P$21 13.97,71.12 15.24,72.39 v17.78,72.39 | v30.48,69.85 31.75,68.58 X1.2 JP5.1
  Bottom 0.406: v17.78,72.39 19.05,72.39 21.59,69.85 v30.48,69.85
RESET  (via drill 0.6)
  Top 0.406: U1.P$24 10.16,67.31 C5.1 6.35,76.2 R4.1 11.43,76.2 v10.16,77.47
  Bottom 0.406: v10.16,77.47 30.48,77.47 31.75,76.2 31.75,73.66 33.02,72.39 35.56,72.39 35.56,73.91 S1.1
RX  (via drill 0.6)
  Top 0.406: U1.P$22 v12.7,69.85 | SV2.4 92.71,68.58 91.44,69.85 JP4.1 v72.39,69.85 | v57.15,69.85 v41.91,69.85
  Bottom 0.406: v72.39,69.85 v57.15,69.85 | v12.7,69.85 13.97,68.58 40.64,68.58 v41.91,69.85
TX  (via drill 0.6)
  Top 0.406: Q1.2 26.67,71.12 29.21,68.58 X1.1 29.21,60.96 31.75,58.42 34.29,58.42 | SV2.3 85.09,66.04 83.82,64.77 83.82,52.07 81.28,49.53 67.31,49.53 66.04,50.8 66.04,57.15 v63.5,59.69 | v35.56,57.15 34.29,58.42 | R7.1 38.1,66.04 34.29,62.23 34.29,58.42
  Bottom 0.406: v63.5,59.69 63.5,58.42 62.23,57.15 v35.56,57.15